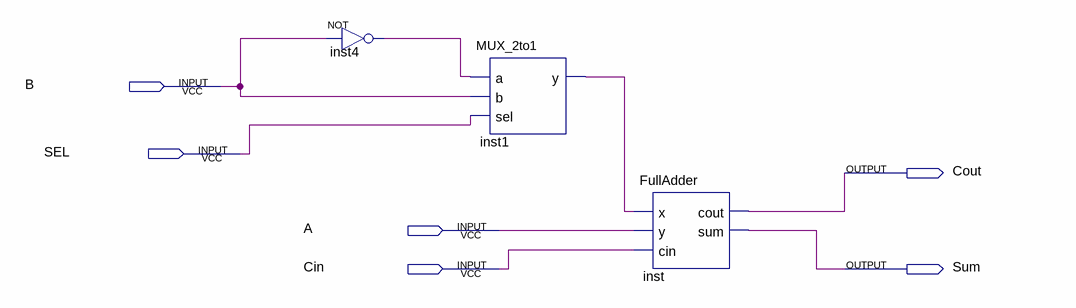
[diagram p0: schematic sheet]
// Quartus schematic blockD2.bdf as structural Verilog: 3 symbols, 6 pins
module blockD2 (
  input  B,
  input  SEL,
  input  A,
  input  Cin,
  output Cout,
  output Sum
);

  wire inst1_y, inst4_out;

  not inst4 (inst4_out, B);
  MUX_2to1 inst1 (.a(inst4_out), .b(B), .sel(SEL), .y(inst1_y));
  FullAdder inst (.x(inst1_y), .y(A), .cin(Cin), .cout(Cout), .sum(Sum));
endmodule
